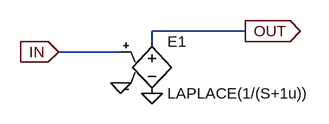
[diagram p0: schematic TransferenceFunction.asc]
TransferenceFunction.asc, the LTspice schematic file:
Version 4
SHEET 1 880 680
WIRE 368 112 224 112
WIRE 224 128 224 112
WIRE 176 144 80 144
FLAG 224 208 0
FLAG 176 192 0
FLAG 80 144 IN
IOPIN 80 144 In
FLAG 368 112 OUT
IOPIN 368 112 Out
SYMBOL e 224 112 R0
SYMATTR InstName E1
SYMATTR Value LAPLACE(1/(S+1u))

The netlist it stands for:
* TransferenceFunction.asc
E1 OUT 0 IN 0 LAPLACE(1/(S+1u))
.backanno
.end